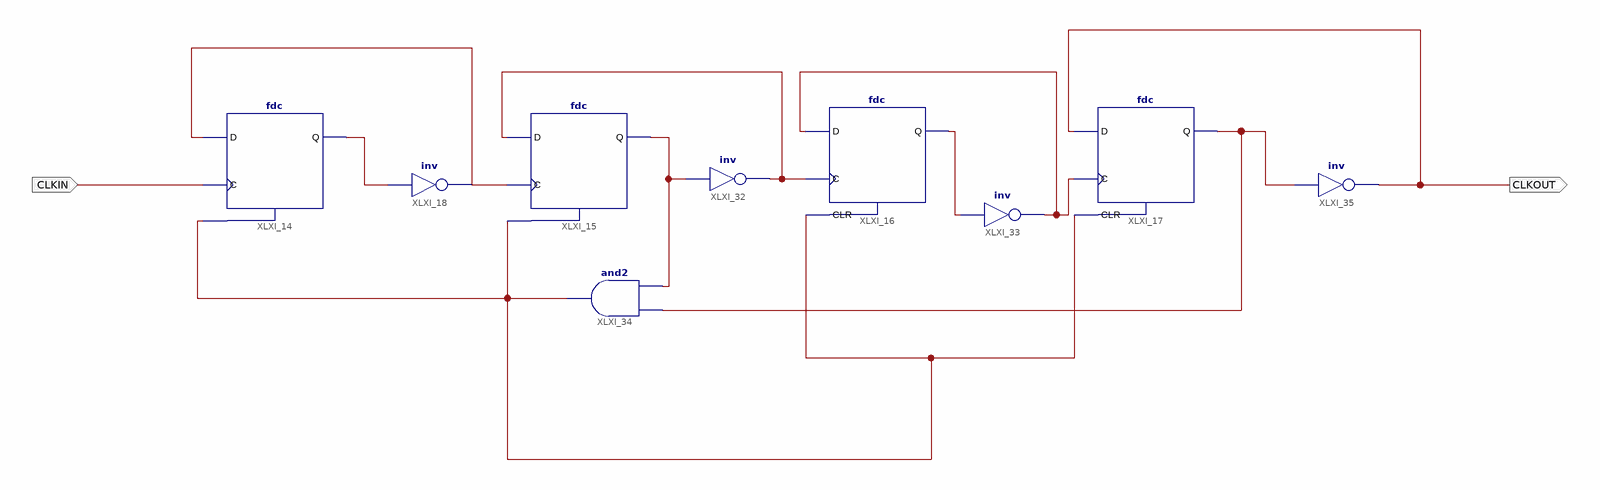
[diagram p0: schematic sheet 1]
// Xilinx ISE schematic DIV10.sch (spartan6) as structural Verilog: 9 symbols, 2 ports
module DIV10 (
  input  CLKIN,
  output CLKOUT
);

  wire XLXN_36, XLXN_38, XLXN_41, XLXN_45, XLXN_48, XLXN_49, XLXN_50, XLXN_51;

  fdc XLXI_16 (.C(XLXN_36), .CLR(XLXN_45), .D(XLXN_38), .Q(XLXN_51));
  fdc XLXI_17 (.C(XLXN_38), .CLR(XLXN_45), .D(CLKOUT), .Q(XLXN_41));
  fdc XLXI_14 (.C(CLKIN), .D(XLXN_49), .Q(XLXN_48));  // open: CLR
  not XLXI_18 (XLXN_49, XLXN_48);
  fdc XLXI_15 (.C(XLXN_49), .D(XLXN_36), .Q(XLXN_50));  // open: CLR
  not XLXI_32 (XLXN_36, XLXN_50);
  not XLXI_33 (XLXN_38, XLXN_51);
  and XLXI_34 (XLXN_45, XLXN_50, XLXN_41);
  not XLXI_35 (CLKOUT, XLXN_41);
endmodule
